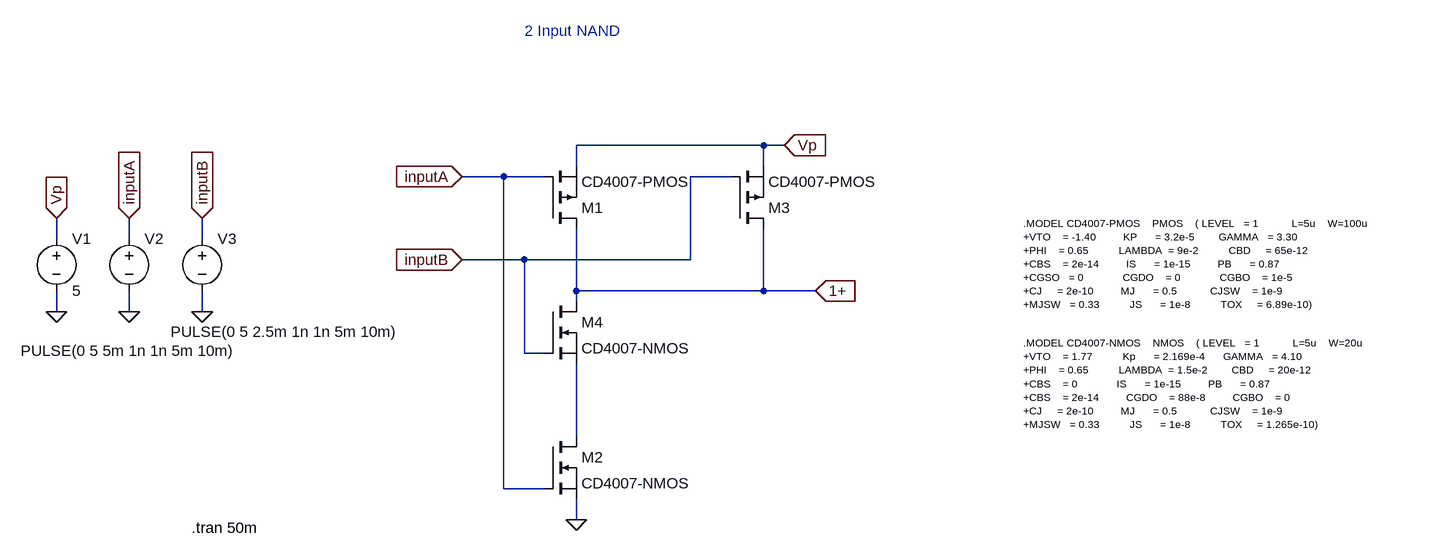
[diagram p0: schematic two_in_nand_ltspice.asc]
two_in_nand_ltspice.asc, the LTspice schematic file:
Version 4
SHEET 1 1176 680
WIRE -512 -160 -800 -160
WIRE -480 -160 -512 -160
WIRE -800 -128 -800 -160
WIRE -512 -128 -512 -160
WIRE -912 -112 -976 -112
WIRE -848 -112 -912 -112
WIRE -560 -112 -624 -112
WIRE -1600 -16 -1600 -48
WIRE -1488 -16 -1488 -48
WIRE -1376 -16 -1376 -48
WIRE -880 16 -976 16
WIRE -624 16 -624 -112
WIRE -624 16 -880 16
WIRE -800 64 -800 -32
WIRE -512 64 -512 -32
WIRE -512 64 -800 64
WIRE -432 64 -512 64
WIRE -800 80 -800 64
WIRE -1600 96 -1600 64
WIRE -1488 96 -1488 64
WIRE -1376 96 -1376 64
WIRE -880 160 -880 16
WIRE -848 160 -880 160
WIRE -800 288 -800 176
WIRE -912 368 -912 -112
WIRE -848 368 -912 368
WIRE -800 416 -800 384
FLAG -800 416 0
FLAG -976 -112 inputA
IOPIN -976 -112 In
FLAG -976 16 inputB
IOPIN -976 16 In
FLAG -480 -160 Vp
IOPIN -480 -160 In
FLAG -432 64 1+
IOPIN -432 64 In
FLAG -1600 96 0
FLAG -1488 96 0
FLAG -1376 96 0
FLAG -1600 -48 Vp
IOPIN -1600 -48 In
FLAG -1488 -48 inputA
IOPIN -1488 -48 In
FLAG -1376 -48 inputB
IOPIN -1376 -48 In
SYMBOL pmos -848 -32 M180
SYMATTR InstName M1
SYMATTR Value CD4007-PMOS
SYMBOL nmos -848 288 R0
SYMATTR InstName M2
SYMATTR Value CD4007-NMOS
SYMBOL pmos -560 -32 M180
SYMATTR InstName M3
SYMATTR Value CD4007-PMOS
SYMBOL nmos -848 80 R0
SYMATTR InstName M4
SYMATTR Value CD4007-NMOS
SYMBOL voltage -1600 -32 R0
WINDOW 123 0 0 Left 0
WINDOW 39 0 0 Left 0
SYMATTR InstName V1
SYMATTR Value 5
SYMBOL voltage -1488 -32 R0
WINDOW 3 -167 188 Left 2
WINDOW 123 0 0 Left 0
WINDOW 39 0 0 Left 0
SYMATTR InstName V2
SYMATTR Value PULSE(0 5 5m 1n 1n 5m 10m)
SYMBOL voltage -1376 -32 R0
WINDOW 3 -48 159 Left 2
WINDOW 123 0 0 Left 0
WINDOW 39 0 0 Left 0
SYMATTR InstName V3
SYMATTR Value PULSE(0 5 2.5m 1n 1n 5m 10m)
TEXT -112 -40 Left 1 !.MODEL CD4007-PMOS    PMOS    ( LEVEL   = 1           L=5u    W=100u                \n+VTO    = -1.40         KP      = 3.2e-5        GAMMA   = 3.30  \n+PHI    = 0.65          LAMBDA  = 9e-2          CBD     = 65e-12\n+CBS    = 2e-14         IS      = 1e-15         PB      = 0.87\n+CGSO   = 0             CGDO    = 0             CGBO    = 1e-5\n+CJ     = 2e-10         MJ      = 0.5           CJSW    = 1e-9\n+MJSW   = 0.33          JS      = 1e-8          TOX     = 6.89e-10)
TEXT -112 144 Left 1 !.MODEL CD4007-NMOS    NMOS    ( LEVEL   = 1           L=5u    W=20u             \n+VTO    = 1.77          Kp      = 2.169e-4      GAMMA   = 4.10  \n+PHI    = 0.65          LAMBDA  = 1.5e-2        CBD     = 20e-12\n+CBS    = 0             IS      = 1e-15         PB      = 0.87\n+CBS    = 2e-14         CGDO    = 88e-8         CGBO    = 0\n+CJ     = 2e-10         MJ      = 0.5           CJSW    = 1e-9\n+MJSW   = 0.33          JS      = 1e-8          TOX     = 1.265e-10)
TEXT -1392 428 Left 2 !.tran 50m
TEXT -880 -336 Left 2 ;2 Input NAND

The netlist it stands for:
* two_in_nand_ltspice.asc
M1 1+ inputA Vp Vp CD4007-PMOS
M2 N001 inputA 0 0 CD4007-NMOS
M3 1+ inputB Vp Vp CD4007-PMOS
M4 1+ inputB N001 N001 CD4007-NMOS
V1 Vp 0 5
V2 inputA 0 PULSE(0 5 5m 1n 1n 5m 10m)
V3 inputB 0 PULSE(0 5 2.5m 1n 1n 5m 10m)
.model NMOS NMOS
.model PMOS PMOS
.lib standard.mos
.MODEL CD4007-PMOS    PMOS    ( LEVEL   = 1           L=5u    W=100u
+VTO    = -1.40         KP      = 3.2e-5        GAMMA   = 3.30
+PHI    = 0.65          LAMBDA  = 9e-2          CBD     = 65e-12
+CBS    = 2e-14         IS      = 1e-15         PB      = 0.87
+CGSO   = 0             CGDO    = 0             CGBO    = 1e-5
+CJ     = 2e-10         MJ      = 0.5           CJSW    = 1e-9
+MJSW   = 0.33          JS      = 1e-8          TOX     = 6.89e-10)
.MODEL CD4007-NMOS    NMOS    ( LEVEL   = 1           L=5u    W=20u
+VTO    = 1.77          Kp      = 2.169e-4      GAMMA   = 4.10
+PHI    = 0.65          LAMBDA  = 1.5e-2        CBD     = 20e-12
+CBS    = 0             IS      = 1e-15         PB      = 0.87
+CBS    = 2e-14         CGDO    = 88e-8         CGBO    = 0
+CJ     = 2e-10         MJ      = 0.5           CJSW    = 1e-9
+MJSW   = 0.33          JS      = 1e-8          TOX     = 1.265e-10)
.tran 50m
* 2 Input NAND
.backanno
.end